# Altium schematic sheet 海关全向电源指示灯板V2.SchDoc
size A4
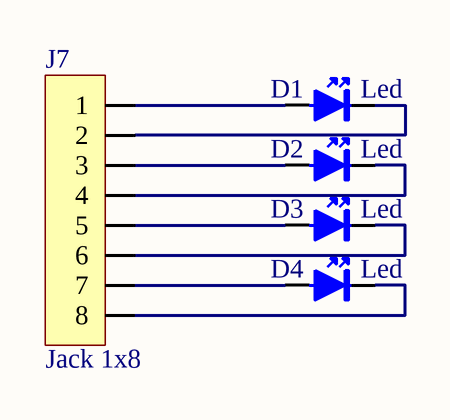
[diagram p0: 海关全向电源指示灯板V2.SchDoc]

## Parts
D1  Led  [Led-D3]
D2  Led  [Led-D3]
D3  Led  [Led-D3]
D4  Led  [Led-D3]
J7  Jack 1x8  [ZH-8AWD]

## Nets
NetD1_1: D1.1(A) J7.1
NetD1_2: D1.2(K) J7.2
NetD2_1: D2.1(A) J7.3
NetD2_2: D2.2(K) J7.4
NetD3_1: D3.1(A) J7.5
NetD3_2: D3.2(K) J7.6
NetD4_1: D4.1(A) J7.7
NetD4_2: D4.2(K) J7.8

## Library data of the parts
D1-D4 = Led: light emitted diode
J7 = Jack 1x8: 插座